# EAGLE design Adapterplatine_v1.2 (EAGLE 7.7.0)
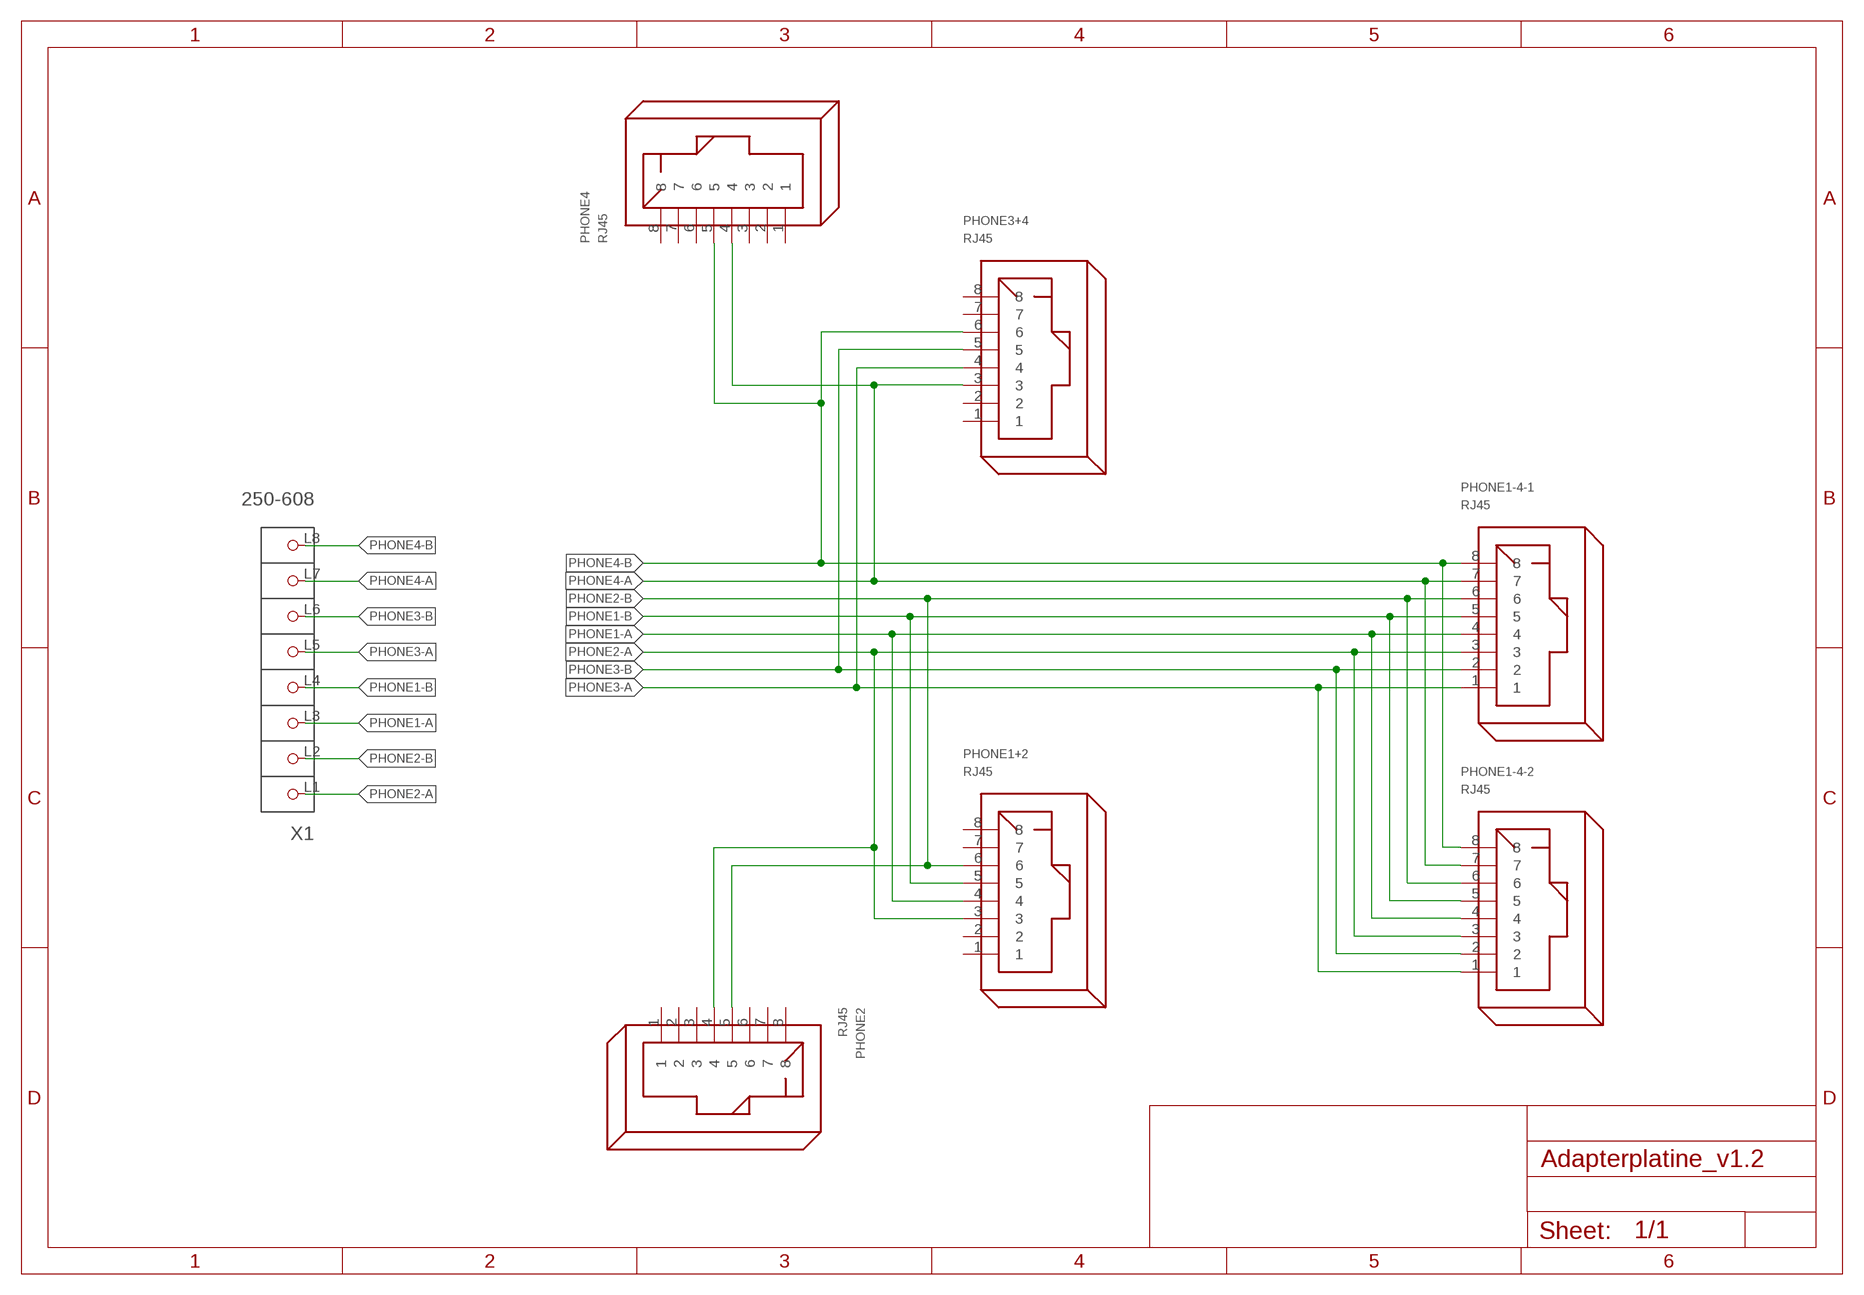
[diagram p0: schematic, sheet 1]

## Parts
PHONE1+2  RJ45  [RJ45]
PHONE1-4-1  RJ45  [RJ45]
PHONE1-4-2  RJ45  [RJ45]
PHONE2  RJ45  [RJ45]
PHONE3+4  RJ45  [RJ45]
PHONE4  RJ45  [RJ45]
X1  250-608  [P-250-608]

## Nets
PHONE1-A: PHONE1+2.4 PHONE1-4-1.4 PHONE1-4-2.4 X1.L3(P3)
PHONE1-B: PHONE1+2.5 PHONE1-4-1.5 PHONE1-4-2.5 X1.L4(P4)
PHONE2-A: PHONE1+2.3 PHONE1-4-1.3 PHONE1-4-2.3 PHONE2.4 X1.L1(P1)
PHONE2-B: PHONE1+2.6 PHONE1-4-1.6 PHONE1-4-2.6 PHONE2.5 X1.L2(P2)
PHONE3-A: PHONE1-4-1.1 PHONE1-4-2.1 PHONE3+4.4 X1.L5(P5)
PHONE3-B: PHONE1-4-1.2 PHONE1-4-2.2 PHONE3+4.5 X1.L6(P6)
PHONE4-A: PHONE1-4-1.7 PHONE1-4-2.7 PHONE3+4.3 PHONE4.4 X1.L7(P7)
PHONE4-B: PHONE1-4-1.8 PHONE1-4-2.8 PHONE3+4.6 PHONE4.5 X1.L8(P8)
Unconnected: PHONE1+2.1 PHONE1+2.2 PHONE1+2.7 PHONE1+2.8 PHONE2.1 PHONE2.2 PHONE2.3 PHONE2.6 PHONE2.7 PHONE2.8 PHONE3+4.1 PHONE3+4.2 PHONE3+4.7 PHONE3+4.8 PHONE4.1 PHONE4.2 PHONE4.3 PHONE4.6 PHONE4.7 PHONE4.8

## Library data of the parts
PHONE1+2 PHONE1-4-1 PHONE1-4-2 PHONE2 PHONE3+4 PHONE4 = con-rj:RJ45: RJ45 RJ45 jacks side mounted http://www.tycoelectronics.com
X1 = con-wago_250:250-608: Serie 250, 1-Leiter-Klemmenleiste für Leiterplatten 1 Lötstift/Pol in Reihe / Series 250, 1-conductor PCB terminal strip 1 solder pin/pole, in line Polzahl / Pole No.: 8 Rastermaß / Pitch: 7.5 - 7.5 mm Bemessungsspannung / Rated Voltage: 630 V Nennstrom / Nominal Current: 17.5 A Leiterquerschnitt / Conductor Size: 0.5 - 1.5 mm2 Anschlusstechnik / Connection Technology: CAGE CLAMP® S Lötstiftlänge: / Solder Pin Length: 4 mm Leitereinführung (zur Platine) / Conductor entry angle (to PCB): 45 ° Farbe / Color: grau / gray Stand: 01.01.2014. Die jeweils aktuellen Daten zu diesem Artikel finden Sie in unserem Produktkatalog, den Sie unter www.wago.com einsehen können. As of: 01/01/2014. Please find the newest data for this article in our product catalogue, which can be viewed under www.wago.com.

## Board
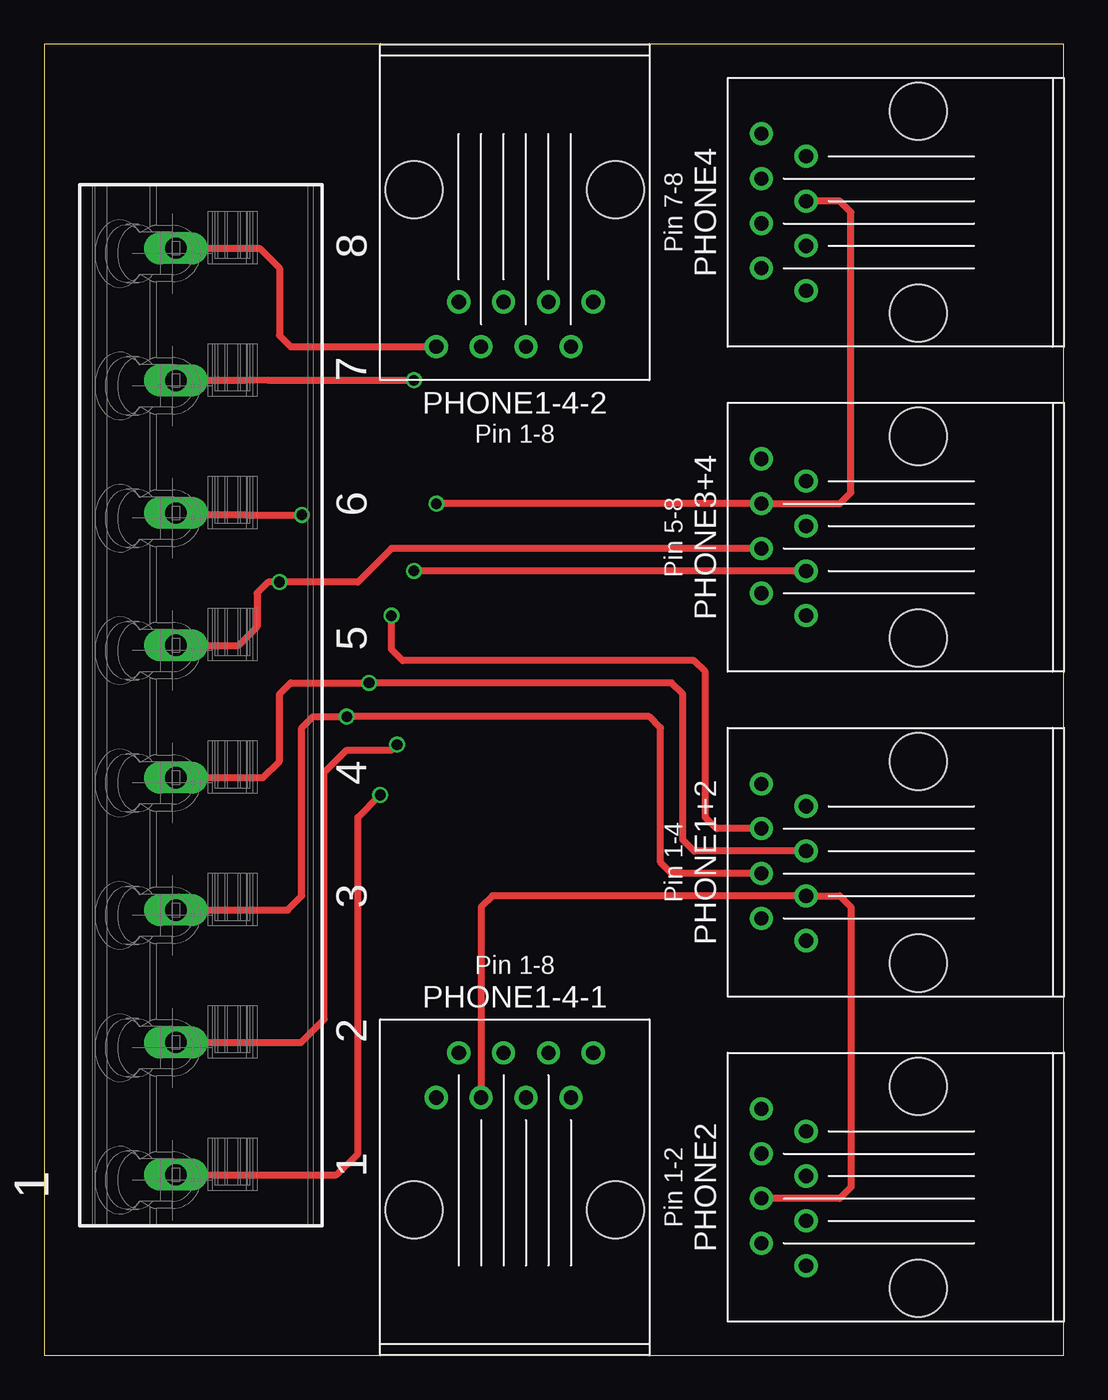
[diagram p1: board, top side]
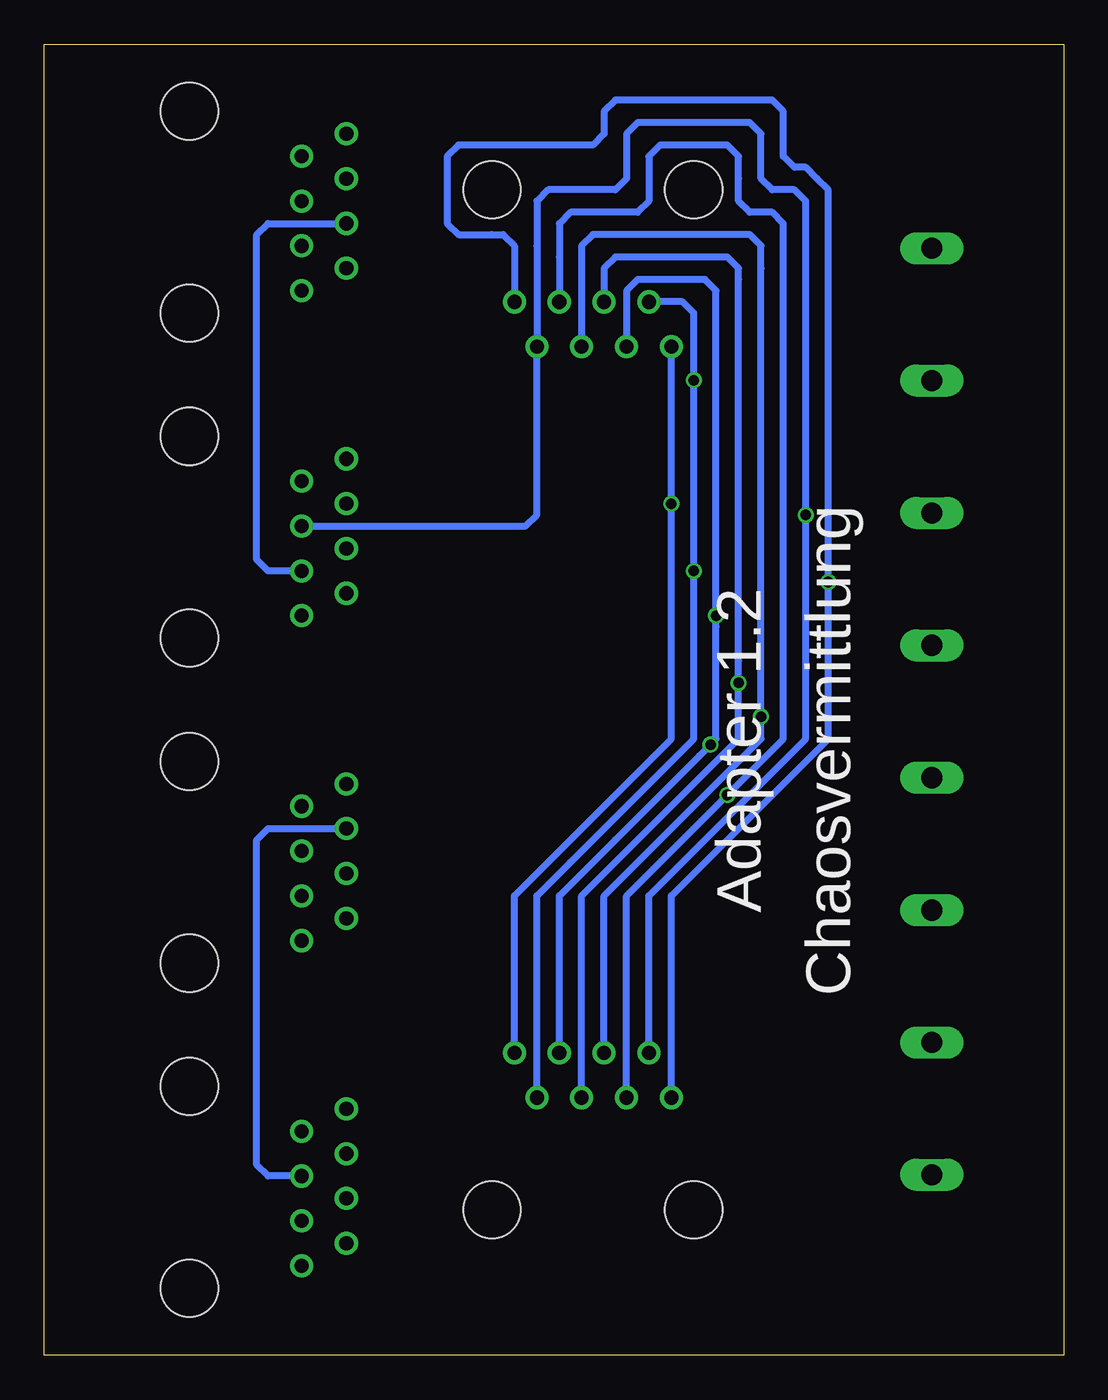
[diagram p2: board, bottom side, seen from below]

Size 57.77 x 74.3 mm. Coordinates in mm from the lower left corner, seen from the top.
Outline: 0,0 57.77,0 57.77,74.3 0,74.3 0,0
Copper layers (1*16): Top 0.035mm / dielectric 1.5mm / Bottom 0.035mm
Design rules "NOA Eagle Rule 2016-06-12": minimum track width 6mil, minimum drill 0.3mm, track to track 6mil, track to pad 6mil, pad to pad 6mil, via to via 6mil, smd to smd 0mil, copper to edge 0.4mm, drill to drill 10mil, minimum pad ring 10mil, minimum via ring 6mil, stop-mask expansion 2mil, vias tented up to drill 25mil, thermal gap 10mil

### Footprints (pad centres in the part's own frame; a part is rotated, then mirrored left to right if it is on the bottom)
RJ45 = drill 0.8: 1 -6.35,-4.445; 2 -8.89,-3.175; 3 -6.35,-1.905; 4 -8.89,-0.635; 5 -6.35,0.635; 6 -8.89,1.905; 7 -6.35,3.175; 8 -8.89,4.445 | hole 3.25: 0,-5.715; 0,5.715
P-250-608 = drill 1.2 long: L1 1.425,26.6; L2 1.425,19.1; L3 1.425,11.6; L4 1.425,4.1; L5 1.425,-3.4; L6 1.425,-10.9; L7 1.425,-18.4; L8 1.425,-25.9

### Placement (x,y rotation side)
PHONE1+2  49.53,27.94 0 top
PHONE1-4-1  26.67,8.26 270 top
PHONE1-4-2  26.67,66.04 90 top
PHONE2  49.53,9.53 0 top
PHONE3+4  49.53,46.35 0 top
PHONE4  49.53,64.77 0 top
X1  8.89,36.83 180 top

### Tracks (layer width: path | path; a pad name or v marks a point on that pad's centre or on a via)
PHONE1-A  (via drill 0.6)
  Top 0.406: PHONE1+2.4 35.56,27.3 34.92,27.94 34.92,35.56 34.29,36.2 v17.14,36.2 15.24,36.2 14.61,35.56 14.61,26.04 13.8,25.23 X1.L3
  Bottom 0.406: PHONE1-4-1.4 26.04,26.04 25.4,26.67 17.14,34.92 v17.14,36.2 17.14,61.59 17.14,62.87 17.78,63.5 26.67,63.5 27.3,62.87 27.3,61.59 PHONE1-4-2.4
PHONE1-B  (via drill 0.6)
  Top 0.406: PHONE1+2.5 36.83,28.57 36.2,29.21 36.2,37.47 35.56,38.1 v18.41,38.1 13.97,38.1 13.34,37.47 13.34,33.66 12.41,32.73 X1.L4
  Bottom 0.406: PHONE1-4-1.5 27.3,26.04 18.41,34.92 v18.41,38.1 18.41,39.37 18.41,60.96 18.41,61.59 19.05,62.23 22.86,62.23 25.4,62.23 26.04,61.59 26.04,60.96 PHONE1-4-2.5
PHONE2-A  (via drill 0.6)
  Top 0.406: PHONE1-4-1.3 24.77,25.4 25.4,26.04 PHONE1+2.3 45.09,26.04 45.72,25.4 45.72,9.53 45.09,8.89 PHONE2.4 | X1.L1 16.58,10.23 17.78,11.43 17.78,30.48 v19.05,31.75
  Bottom 0.406: PHONE1-4-1.3 24.77,26.04 22.86,27.94 19.68,31.11 | 19.68,31.11 v19.05,31.75 | v19.05,31.75 15.88,34.92 15.88,62.23 15.88,63.5 15.88,64.14 16.51,64.77 17.78,64.77 18.41,65.41 18.41,66.67 18.41,67.94 19.05,68.58 22.86,68.58 23.5,67.94 23.5,65.41 24.13,64.77 27.94,64.77 28.57,64.14 28.57,62.23 PHONE1-4-2.3 | v19.05,31.75 19.68,31.11
PHONE2-B  (via drill 0.6)
  Top 0.406: PHONE1+2.6 38.1,29.84 37.47,30.48 37.47,38.73 36.83,39.37 20.32,39.37 19.68,40.01 v19.68,41.91 | X1.L2 14.55,17.73 15.88,19.05 15.88,33.02 17.14,34.29 19.68,34.29 v20,34.61
  Bottom 0.406: PHONE1-4-1.6 28.57,26.04 25.4,29.21 20.64,33.97 | 20.64,33.97 v20,34.61 | v20,34.61 19.68,34.92 19.68,41.27 v19.68,41.91 19.68,60.33 20.32,60.96 24.13,60.96 24.77,60.33 PHONE1-4-2.6 | PHONE2.5 45.09,10.16 45.72,10.79 45.72,29.21 45.09,29.84 PHONE1+2.6 | v20,34.61 20.64,33.97
PHONE3-A  (via drill 0.6)
  Top 0.406: PHONE3+4.4 22.86,45.72 19.68,45.72 17.78,43.81 v13.34,43.81 12.7,43.81 12.06,43.18 12.06,41.27 11.02,40.23 X1.L5
  Bottom 0.406: PHONE1-4-1.1 22.23,26.04 13.34,34.92 13.34,43.18 v13.34,43.81 13.34,63.5 13.34,66.04 13.97,66.67 14.61,67.31 15.24,67.31 15.88,67.94 15.88,70.48 16.51,71.12 25.4,71.12 26.04,70.48 26.04,69.22 26.67,68.58 34.29,68.58 34.92,67.94 34.92,64.14 34.29,63.5 32.38,63.5 31.75,63.5 31.11,62.87 PHONE1-4-2.1
PHONE3-B  (via drill 0.6)
  Top 0.406: v14.61,47.62 11.43,47.62 7.57,47.62 arc-90 X1.L6
  Bottom 0.406: PHONE1-4-1.2 23.5,26.04 14.61,34.92 14.61,45.09 v14.61,47.62 14.61,62.87 14.61,65.41 15.24,66.04 16.51,66.04 17.14,66.67 17.14,69.22 17.78,69.85 24.13,69.85 24.77,69.22 24.77,66.67 25.4,66.04 29.21,66.04 29.84,65.41 29.84,62.87 PHONE1-4-2.2 29.84,47.62 30.48,46.99 PHONE3+4.5
PHONE4-A  (via drill 0.6)
  Top 0.406: v20.95,55.24 16.51,55.24 12.7,55.24 11.41,55.23 X1.L7 | PHONE3+4.3 v20.95,44.45
  Bottom 0.406: PHONE1-4-1.7 29.84,26.04 27.94,27.94 20.95,34.92 v20.95,44.45 v20.95,55.24 20.95,59.05 21.59,59.69 PHONE1-4-2.7 | PHONE3+4.3 45.09,44.45 45.72,45.09 45.72,63.5 45.09,64.14 PHONE4.4
PHONE4-B  (via drill 0.6)
  Top 0.406: X1.L8 12.2,62.73 13.34,61.59 13.34,57.78 13.97,57.15 PHONE1-4-2.8 | v22.23,48.26 PHONE3+4.6 45.09,48.26 45.72,48.9 45.72,62.87 45.72,64.77 45.09,65.41 PHONE4.5
  Bottom 0.406: PHONE1-4-1.8 31.11,26.04 29.84,27.3 22.23,34.92 v22.23,48.26 PHONE1-4-2.8

### Text on the board
tNames: Pin 7-8 | 8 | 7 | Pin 1-8 | 6 | Pin 5-8 | 5 | 4 | Pin 1-4 | 3 | Pin 1-8 | 2 | 1 | Pin 1-2
bNames: Chaosvermittlung | Adapter 1.2